# Altium schematic sheet Flyback.SchDoc
size A4
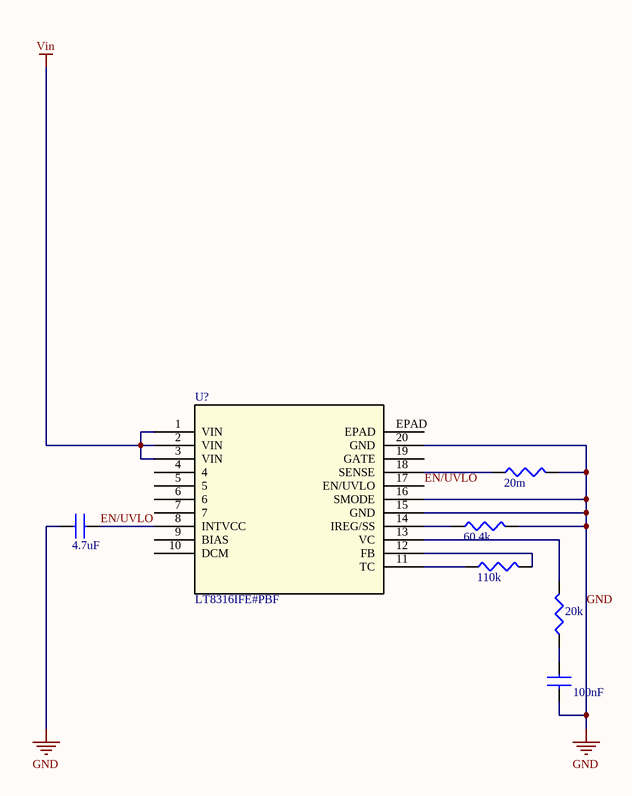
[diagram p0: Flyback.SchDoc]

## Parts
(Parts that share a designator on the sheet are numbered #1, #2 ... from top to bottom, then left to right.)
C?#1  4.7uF
C?#2  100nF
R?#1  20m
R?#2  60.4k
R?#3  110k
R?#4  20k
U?  LT8316IFE#PBF  [LT8316IFE]

## Nets
GND: C?#1.1 C?#2.1 R?#1.2 R?#2.2 U?.15(GND) U?.16(SMODE) U?.20(GND)
Vin: U?.1(VIN) U?.2(VIN) U?.3(VIN)
EN/UVLO: C?#1.2 U?.8(INTVCC) U?.17(EN/UVLO)
NetC?#2_2: C?#2.2 R?#4.1
NetR?#1_1: R?#1.1 U?.18(SENSE)
NetR?#2_1: R?#2.1 U?.14(IREG/SS)
NetR?#3_1: R?#3.1 U?.11(TC)
NetR?#3_2: R?#3.2 U?.12(FB)
NetR?#4_2: R?#4.2 U?.13(VC)

Not connected (* = marked no-connect by the designer): U? 4 5 6 7 9(BIAS) 10(DCM) 19(GATE) EPAD

## Library data of the parts
C?#1 = GRM219R61E475MA73D: CAP CER 4.7UF 25V X5R 0805; Manufacturer: Murata; Tolerance: 20%; Supplier 1: Digi-Key; Supplier Part Number 1: 490-14644-1-ND; Manufacturer Part Number: GRM219R61E475MA73D; RoHS: Yes; Category: Ceramic Capacitors; Stock 1: 107733; Pricing 1: 1=0,28000, 10=0,19400, 50=0,11640, 100=0,09830, 500=0,06728, 1000=0,05951 (USD); Mount: Surface Mount; Case/Package: 0805; Min Operating Temperature: -55°C; Max Operating Temperature: 85°C; Packaging: Tape and Reel; Capacitance: 4.7uF; Voltage Rating: 25V; Voltage Rating (DC): 25V; Dielectric: X5R; Length: 0.079inch; Width: 0.049inch; Thickness: 0.037inch; RoHS Compliant: Yes; ComponentLink1URL: http://search.murata.co.jp/Ceramy/image/img/A01X/G101/ENG/GRM219R61E475MA73-01.pdf?src-supplier=Digi-Key; ComponentLink1Description: http://search.murata.co.jp/Ceramy/image/img/A01X/G101/ENG/GRM219R61E475MA73-01.pdf?src-supplier=Digi-Key; ComponentLink2URL: https://search.murata.co.jp/Ceramy/image/img/A01X/G101/ENG/GRM219R61E475MA73-01.pdf?src-supplier=Digi-Key; ComponentLink2Description: https://search.murata.co.jp/Ceramy/image/img/A01X/G101/ENG/GRM219R61E475MA73-01.pdf?src-supplier=Digi-Key
C?#2 = GRM155R71E104KE14J: CAP CER 0.1UF 25V X7R 0402; Manufacturer: Murata; Tolerance: 10%; Supplier 1: Digi-Key; Supplier Part Number 1: 490-14603-1-ND; Manufacturer Part Number: GRM155R71E104KE14J; RoHS: Yes; Category: Capacitors; Stock 1: 1830340; Pricing 1: 1=0,10000, 10=0,02800, 50=0,01520, 100=0,01240, 500=0,00886, 1000=0,00696, 2500=0,00632, 5000=0,00582 (USD); Mount: Surface Mount; Case/Package: 0402; Case Code (Imperial): 0402; Case Code (Metric): 1005; Weight: 0.000212oz; Min Operating Temperature: -55°C; Max Operating Temperature: 125°C; Packaging: Tape and Reel; Capacitance: 100nF; Voltage Rating: 25V; Dielectric: X7R; Termination: SMD/SMT; Resistor Type: Ceramic; Voltage Rating (DC): 25V; Package Quantity: 50000; Length: 0.039inch; Width: 0.5mm; Height: 0.5mm; Thickness: 0.022inch; RoHS Compliant: Yes; ComponentLink1URL: http://www.mouser.com/ds/2/281/c02e-2905.pdf?src-supplier=Mouser; ComponentLink1Description: http://www.mouser.com/ds/2/281/c02e-2905.pdf?src-supplier=Mouser; ComponentLink2URL: http://search.murata.co.jp/Ceramy/image/img/A01X/G101/ENG/GRM155R71E104KE14-01.pdf?src-supplier=Digi-Key; ComponentLink2Description: http://search.murata.co.jp/Ceramy/image/img/A01X/G101/ENG/GRM155R71E104KE14-01.pdf?src-supplier=Digi-Key
R?#1 = RL1220T-R020-J: TR / Current Sensors, 0805 0.25W, 5%; Manufacturer: Susumu; Power Rating: 250mW; Resistance: 20mR; Temperature Coefficient: 350ppm/°C; Voltage Rating (DC): 100V; Supplier 1: Digi-Key; Supplier Part Number 1: RL12T.020JCT-ND; Manufacturer Part Number: RL1220T-R020-J; RoHS: Yes; Category: Resistors; Stock 1: 301682; Pricing 1: 1=0,35000, 10=0,30000, 25=0,21840, 50=0,15840, 100=0,11740, 250=0,09008, 500=0,07098, 1000=0,04914 (USD); Case/Package: 0805; Case Code (Metric): 2012; Case Code (Imperial): 0805; Weight: 0.000194oz; Min Operating Temperature: -55°C; Max Operating Temperature: 125°C; Tolerance: 5%; Package Quantity: 1; Packaging: Tape and Reel; Series: RL; Resistor Type: Thin Film; Number of Terminations: 2; Termination: SMD/SMT; Max Power Dissipation: 250mW; Technology: THIN FILM; Length: 0.079inch; Width: 0.049inch; Height: 0.028inch; Lead Free: Lead Free; RoHS Compliant: Yes; ComponentLink1URL: https://datasheet.ciiva.com/2488/rl-data-sheet-2488002.pdf?src-supplier=Digi-Key; ComponentLink1Description: https://datasheet.ciiva.com/2488/rl-data-sheet-2488002.pdf?src-supplier=Digi-Key; ComponentLink2URL: https://datasheet.ciiva.com/2488/rl-data-sheet-2488003.pdf?src-supplier=Digi-Key; ComponentLink2Description: https://datasheet.ciiva.com/2488/rl-data-sheet-2488003.pdf?src-supplier=Digi-Key; ComponentLink3URL: https://datasheet.ciiva.com/2488/rl-data-sheet-2488004.pdf?src-supplier=Digi-Key; ComponentLink3Description: https://datasheet.ciiva.com/2488/rl-data-sheet-2488004.pdf?src-supplier=Digi-Key; ComponentLink4URL: https://datasheet.ciiva.com/12915/e-15-16-12915302.pdf?src-supplier=Mouser; ComponentLink4Description: https://datasheet.ciiva.com/12915/e-15-16-12915302.pdf?src-supplier=Mouser
R?#2 = CRCW060360K4FKEA: VISHAY - CRCW060360K4FKEA - SMD Chip Resistor, 0603 [1608 Metric], 60.4 kohm, CRCW e3 Series, 75 V, Thick Film, 100 mW; Voltage Rating: 75V; Resistance: 60.4kR; Power Rating: 100mW; Tolerance: 1%; Temperature Coefficient: 100ppm/°C; Supplier 1: Digi-Key; Supplier Part Number 1: 541-60.4KHCT-ND; Manufacturer: Vishay; Manufacturer Part Number: CRCW060360K4FKEA; RoHS: Yes; Category: Resistors; Stock 1: 3660; Pricing 1: 1=0,10000, 10=0,03600, 100=0,01450, 1000=0,00652, 2500=0,00566 (USD); Case/Package: 0603; Weight: 7.1E-05oz; Case Code (Metric): 1608; Case Code (Imperial): 0603; Contact Plating: Tin; Size Code: 0603; Min Operating Temperature: -55°C; Max Operating Temperature: 155°C; Packaging: Tape and Reel; Package Quantity: 10; Resistor Type: Thick Film; Number of Terminations: 2; Termination: SMD/SMT; Max Power Dissipation: 100mW; Voltage Rating (DC): 75V; Features: Automotive AEC-Q200; Series: CRCW; Resistance Tolerance: 1%; Technology: THICK FILM; Construction: Rectangular; Length: 1.55mm; Width: 0.033inch; Height: 0.45mm; Depth: 0.85mm; Radiation Hardening: No; REACH SVHC: Unknown; Military Standard: Not; Lead Free: Lead Free; RoHS Compliant: Yes; ComponentLink1URL: https://datasheet.ciiva.com/11809/0900766b80d98afc-11809685.pdf?src-supplier=RSComponents; ComponentLink1Description: https://datasheet.ciiva.com/11809/0900766b80d98afc-11809685.pdf?src-supplier=RSComponents; ComponentLink2URL: https://datasheet.ciiva.com/7816/1697337-7816053.pdf?src-supplier=Element14; ComponentLink2Description: https://datasheet.ciiva.com/7816/1697337-7816053.pdf?src-supplier=Element14; ComponentLink3URL: https://datasheet.ciiva.com/2494/dcrcwe3-2494471.pdf?src-supplier=Digi-Key; ComponentLink3Description: https://datasheet.ciiva.com/2494/dcrcwe3-2494471.pdf?src-supplier=Digi-Key; ComponentLink4URL: https://datasheet.ciiva.com/16760/70201119-16760503.pdf?src-supplier=Allied+Electronics; ComponentLink4Description: https://datasheet.ciiva.com/16760/70201119-16760503.pdf?src-supplier=Allied+Electronics; ComponentLink5URL: https://datasheet.ciiva.com/2494/dcrcwe3-2494472.pdf?src-supplier=Digi-Key; ComponentLink5Description: https://datasheet.ciiva.com/2494/dcrcwe3-2494472.pdf?src-supplier=Digi-Key; ComponentLink6URL: https://datasheet.ciiva.com/16391/dcrcwe3-16391304.pdf?src-supplier=Future+Electronics; ComponentLink6Description: https://datasheet.ciiva.com/16391/dcrcwe3-16391304.pdf?src-supplier=Future+Electronics; ComponentLink7URL: https://datasheet.ciiva.com/16893/dcrcwe3-16893592.pdf?src-supplier=Avnet+Europe; ComponentLink7Description: https://datasheet.ciiva.com/16893/dcrcwe3-16893592.pdf?src-supplier=Avnet+Europe; ComponentLink8URL: https://datasheet.ciiva.com/2494/dcrcwe3-2494473.pdf?src-supplier=Digi-Key; ComponentLink8Description: https://datasheet.ciiva.com/2494/dcrcwe3-2494473.pdf?src-supplier=Digi-Key; ComponentLink9URL: https://datasheet.ciiva.com/5545/dcrcwe3-109170-5545721.pdf?src-supplier=Mouser; ComponentLink9Description: https://datasheet.ciiva.com/5545/dcrcwe3-109170-5545721.pdf?src-supplier=Mouser; ComponentLink10URL: https://datasheet.ciiva.com/3257/dcrcwe3-3257786.pdf?src-supplier=Avnet; ComponentLink10Description: https://datasheet.ciiva.com/3257/dcrcwe3-3257786.pdf?src-supplier=Avnet; ComponentLink11URL: https://datasheet.ciiva.com/22676/1847332-22676330.pdf?src-supplier=Element14; ComponentLink11Description: https://datasheet.ciiva.com/22676/1847332-22676330.pdf?src-supplier=Element14; ComponentLink12URL: https://datasheet.ciiva.com/3257/dcrcwe3-3257787.pdf?src-supplier=Avnet; ComponentLink12Description: https://datasheet.ciiva.com/3257/dcrcwe3-3257787.pdf?src-supplier=Avnet
R?#3 = CRCW0603110KJNEA: RES SMD 110K OHM 5% 1/10W 0603; Manufacturer: Vishay Dale; Resistance: 110kR; Power Rating: 100mW; Voltage Rating: 75V; Temperature Coefficient: 200ppm/°C; Supplier 1: Digi-Key; Supplier Part Number 1: 541-110KGCT-ND; Manufacturer Part Number: CRCW0603110KJNEA; RoHS: Yes; Category: Resistors; Stock 1: 16475; Pricing 1: 1=0,10000, 10=0,03200, 100=0,01310, 1000=0,00588, 2500=0,00510 (USD); Case/Package: 0603; Weight: 7.1E-05oz; Case Code (Imperial): 0603; Case Code (Metric): 1608; Contact Plating: Tin; Min Operating Temperature: -55°C; Max Operating Temperature: 155°C; Tolerance: 5%; Packaging: Tape and Reel; Package Quantity: 1; Termination: SMD/SMT; Resistor Type: Thick Film; Number of Terminations: 2; Max Power Dissipation: 100mW; Voltage Rating (DC): 75V; Features: Automotive AEC-Q200; Series: CRCW; Construction: Rectangular; Length: 1.55mm; Width: 0.85mm; Height: 0.02inch; Depth: 0.85mm; Radiation Hardening: No; Military Standard: Not; Lead Free: Lead Free; RoHS Compliant: Yes; ComponentLink1URL: https://datasheet.ciiva.com/3256/dcrcwe3-3256965.pdf?src-supplier=Avnet; ComponentLink1Description: https://datasheet.ciiva.com/3256/dcrcwe3-3256965.pdf?src-supplier=Avnet; ComponentLink2URL: https://datasheet.ciiva.com/5549/dcrcwe3-109170-5549509.pdf?src-supplier=Mouser; ComponentLink2Description: https://datasheet.ciiva.com/5549/dcrcwe3-109170-5549509.pdf?src-supplier=Mouser; ComponentLink3URL: https://datasheet.ciiva.com/2493/dcrcwe3-2493661.pdf?src-supplier=Digi-Key; ComponentLink3Description: https://datasheet.ciiva.com/2493/dcrcwe3-2493661.pdf?src-supplier=Digi-Key; ComponentLink4URL: https://datasheet.ciiva.com/2493/dcrcwe3-2493662.pdf?src-supplier=Digi-Key; ComponentLink4Description: https://datasheet.ciiva.com/2493/dcrcwe3-2493662.pdf?src-supplier=Digi-Key; ComponentLink5URL: https://datasheet.ciiva.com/2493/dcrcwe3-2493663.pdf?src-supplier=Digi-Key; ComponentLink5Description: https://datasheet.ciiva.com/2493/dcrcwe3-2493663.pdf?src-supplier=Digi-Key
R?#4 = CRCW060320K0FKEAC: D11/CRCW0603-C 100 20K 1% ET1; Manufacturer: Vishay; Power Rating: 100mW; Resistance: 20kR; Temperature Coefficient: 100ppm/°C; Supplier 1: Digi-Key; Supplier Part Number 1: 541-3987-1-ND; Manufacturer Part Number: CRCW060320K0FKEAC; RoHS: Yes; Category: Resistors; Stock 1: 87681; Pricing 1: 1=0,10000, 10=0,03600, 100=0,01450, 1000=0,00652, 2500=0,00566 (USD); Mount: Surface Mount; Case/Package: Molded; Contact Plating: Tin; Min Operating Temperature: -55°C; Max Operating Temperature: 155°C; Tolerance: 1%; Resistor Type: Thick Film; Termination: Wraparound; Length: 1.55mm; Lead Free: Lead Free; RoHS Compliant: Yes; ComponentLink1URL: http://www.vishay.com/docs/28773/crcwce3.pdf?src-supplier=Digi-Key; ComponentLink1Description: http://www.vishay.com/docs/28773/crcwce3.pdf?src-supplier=Digi-Key
U? = LT8316IFE#PBF: Manufacturer: Analog Devices; Supplier 1: Digi-Key; Supplier Part Number 1: LT8316IFE#PBF-ND; Manufacturer Part Number: LT8316IFE#PBF; RoHS: Yes; Category: Voltage Regulators - Switching; Stock 1: 319; Pricing 1: 1=6,26000, 10=5,62600, 25=5,31840, 100=4,60940, 250=4,37304, 500=3,92390, 1000=3,34500 (USD)